# Altium schematic sheet 12_OLED_SCREEN.SchDoc
size A
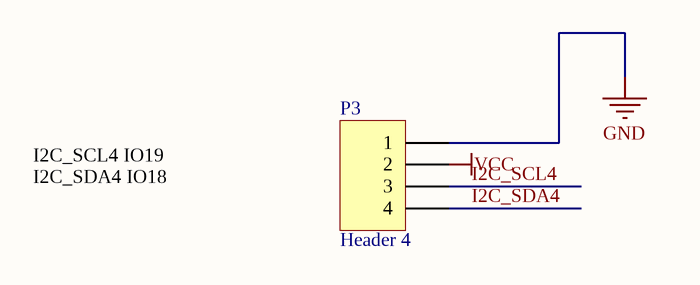
[diagram p0: 12_OLED_SCREEN.SchDoc]

## Parts
P3  Header 4  [HDR1X4]

## Nets
GND: P3.1
VCC: P3.2
I2C_SCL4: P3.3
I2C_SDA4: P3.4

## Notes on the sheet
- I2C_SCL4 IO19
  I2C_SDA4 IO18

## Library data of the parts
P3 = Header 4: Header, 4-Pin; LatestRevisionDate: 17-Jul-2002; LatestRevisionNote: Re-released for DXP Platform.; Publisher: Altium Limited